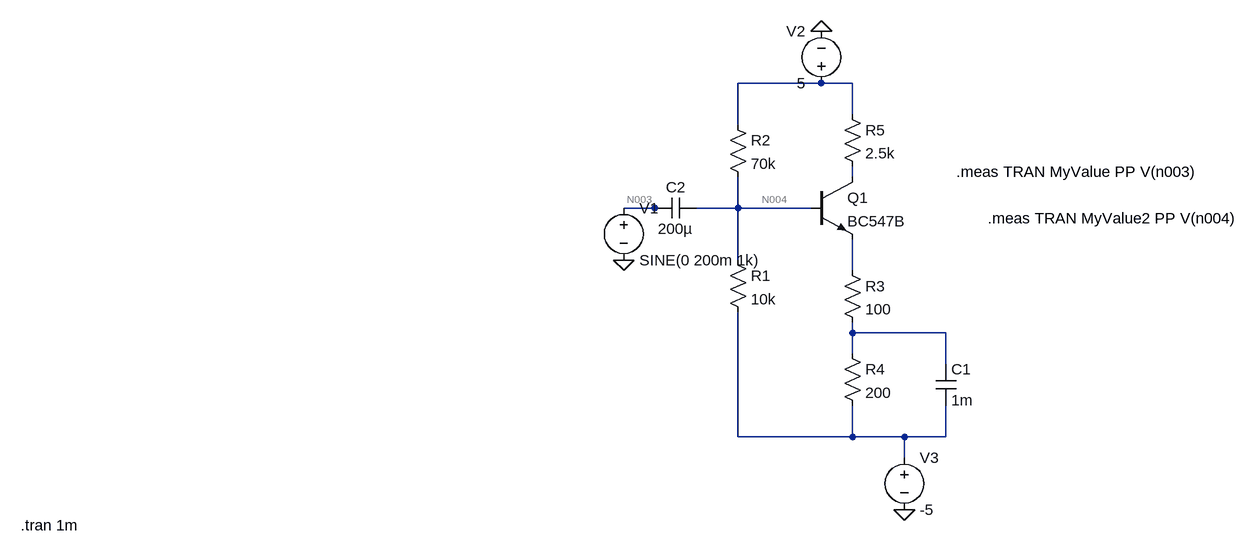
[diagram p0: schematic Gain.asc]
Gain.asc, the LTspice schematic file:
Version 4
SHEET 1 912 680
WIRE 256 -144 128 -144
WIRE 304 -144 256 -144
WIRE 304 -96 304 -144
WIRE 128 -80 128 -144
WIRE 304 0 304 -16
WIRE 0 48 -48 48
WIRE 16 48 0 48
WIRE 128 48 128 0
WIRE 128 48 64 48
WIRE 240 48 128 48
WIRE 128 128 128 48
WIRE 304 144 304 96
WIRE 304 240 304 224
WIRE 448 240 304 240
WIRE 304 272 304 240
WIRE 448 288 448 240
WIRE 128 400 128 208
WIRE 304 400 304 352
WIRE 304 400 128 400
WIRE 384 400 304 400
WIRE 448 400 448 352
WIRE 448 400 384 400
WIRE 384 432 384 400
FLAG 256 -224 0
FLAG 384 512 0
FLAG -48 128 0
SYMBOL res 112 112 R0
SYMATTR InstName R1
SYMATTR Value 10k
SYMBOL voltage 256 -128 R180
WINDOW 0 24 96 Left 2
WINDOW 3 24 16 Left 2
SYMATTR InstName V2
SYMATTR Value 5
SYMBOL npn 240 0 R0
SYMATTR InstName Q1
SYMATTR Value BC547B
SYMBOL res 288 128 R0
SYMATTR InstName R3
SYMATTR Value 100
SYMBOL res 288 256 R0
SYMATTR InstName R4
SYMATTR Value 200
SYMBOL cap 432 288 R0
SYMATTR InstName C1
SYMATTR Value 1m
SYMBOL res 288 -112 R0
SYMATTR InstName R5
SYMATTR Value 2.5k
SYMBOL voltage 384 416 R0
SYMATTR InstName V3
SYMATTR Value -5
SYMBOL cap 64 32 R90
WINDOW 0 0 32 VBottom 2
WINDOW 3 32 32 VTop 2
SYMATTR InstName C2
SYMATTR Value 200µ
SYMBOL res 112 -96 R0
SYMATTR InstName R2
SYMATTR Value 70k
SYMBOL voltage -48 32 R0
WINDOW 123 0 0 Left 0
WINDOW 39 0 0 Left 0
SYMATTR InstName V1
SYMATTR Value SINE(0 200m 1k)
TEXT -976 536 Left 2 !.tran 1m
TEXT 464 -8 Left 2 !.meas TRAN MyValue PP V(n003)
TEXT 512 64 Left 2 !.meas TRAN MyValue2 PP V(n004)

The netlist it stands for:
* Gain.asc
R1 N004 N007 10k
V2 N001 0 5
Q1 N002 N004 N005 0 BC547B
R3 N005 N006 100
R4 N006 N007 200
C1 N006 N007 1m
R5 N001 N002 2.5k
V3 N007 0 -5
C2 N004 N003 200µ
R2 N001 N004 70k
V1 N003 0 SINE(0 200m 1k)
.model NPN NPN
.model PNP PNP
.lib standard.bjt
.tran 1m
.meas TRAN MyValue PP V(n003)
.meas TRAN MyValue2 PP V(n004)
.backanno
.end